# Altium schematic sheet [02] BLOCK DIAGRAM.SchDoc: template
size 292 x 193 mm; Author: Hom; CompanyName: KitSprout; DrawnBy: Hom; Engineer: Hom; Organization: KitSprout; Revision: A; SheetNumber: 2; SheetTotal: 3; LibVersion: v3.6; Version: v1.0A

## Notes on the sheet
- Title
- Size:
- Date:
- A4
- Number:
- Time:
- Revision:
- Sheet
- of
- File: